# EAGLE design source_eagle (EAGLE 9.6.2)
COMPANY: ADAFRUIT INDUSTRIES; DRAWN: KTOWN; REV: A; YEAR: 2017
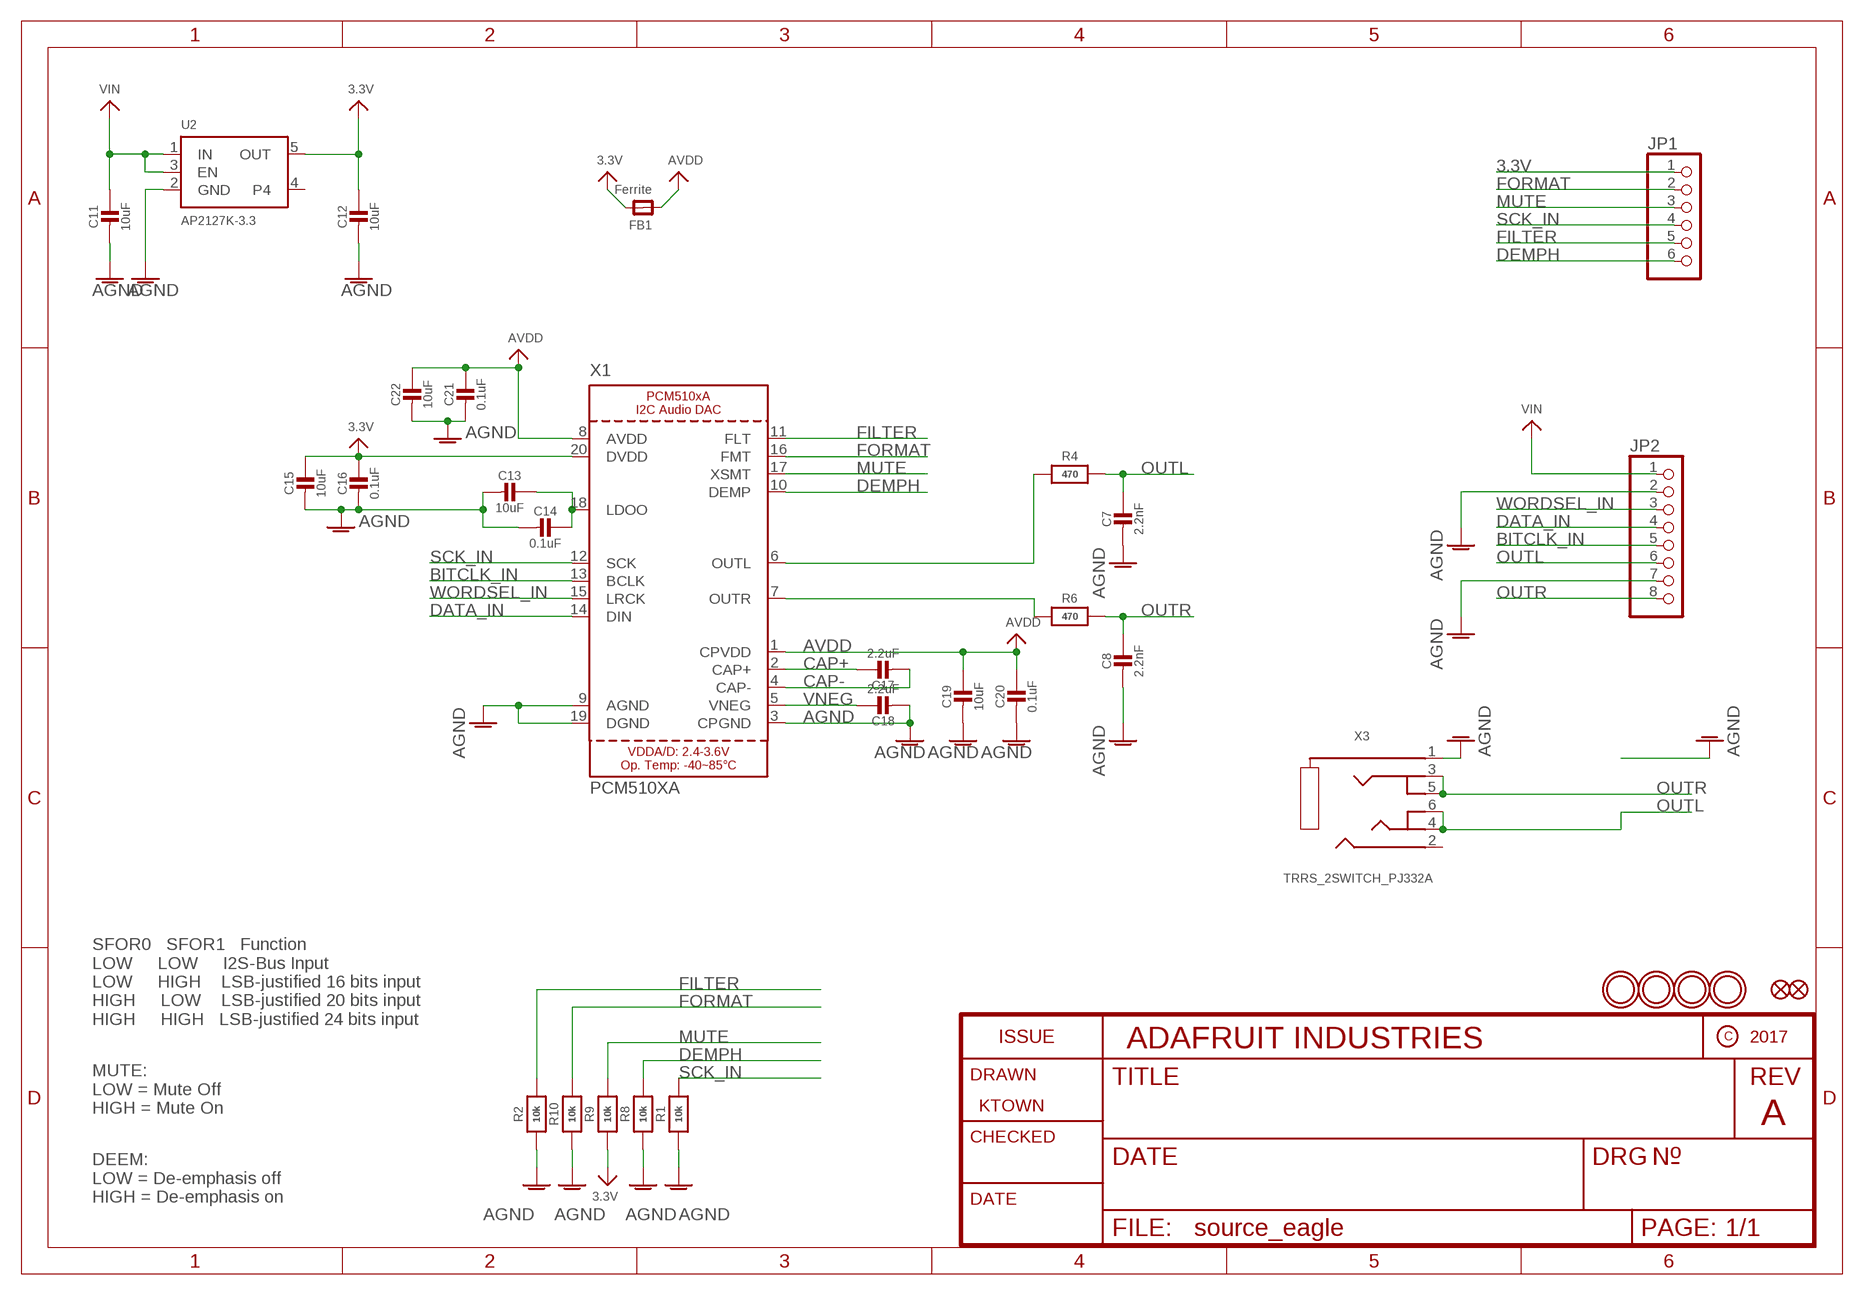
[diagram p0: schematic, sheet 1]

## Parts
C7  2.2nF  CAP_CERAMIC0603_NO  [0603-NO]
C8  2.2nF  CAP_CERAMIC0603_NO  [0603-NO]
C11  10uF  CAP_CERAMIC0805-NOOUTLINE  [0805-NO]
C12  10uF  CAP_CERAMIC0805-NOOUTLINE  [0805-NO]
C13  10uF  CAP_CERAMIC0805-NOOUTLINE  [0805-NO]
C14  0.1uF  CAP_CERAMIC0603_NO  [0603-NO]
C15  10uF  CAP_CERAMIC0805-NOOUTLINE  [0805-NO]
C16  0.1uF  CAP_CERAMIC0603_NO  [0603-NO]
C17  2.2uF  CAP_CERAMIC0603_NO  [0603-NO]
C18  2.2uF  CAP_CERAMIC0603_NO  [0603-NO]
C19  10uF  CAP_CERAMIC0805-NOOUTLINE  [0805-NO]
C20  0.1uF  CAP_CERAMIC0603_NO  [0603-NO]
C21  0.1uF  CAP_CERAMIC0603_NO  [0603-NO]
C22  10uF  CAP_CERAMIC0805-NOOUTLINE  [0805-NO]
FB1  Ferrite  FERRITE-0603NO  [0603-NO]
FID1  FIDUCIAL_0.5MM  [FIDUCIAL_0.5MM]
FID2  FIDUCIAL_0.5MM  [FIDUCIAL_0.5MM]
JP1  HEADER-1X670MIL  [1X06_ROUND_70]
JP2  HEADER-1X8ROUND  [1X08_ROUND]
R1  10k  RESISTOR_0603_NOOUT  [0603-NO]
R2  10k  RESISTOR_0603_NOOUT  [0603-NO]
R4  470  RESISTOR_0603_NOOUT  [0603-NO]
R6  470  RESISTOR_0603_NOOUT  [0603-NO]
R8  10k  RESISTOR_0603_NOOUT  [0603-NO]
R9  10k  RESISTOR_0603_NOOUT  [0603-NO]
R10  10k  RESISTOR_0603_NOOUT  [0603-NO]
U2  AP2127K-3.3  VREG_SOT23-5  [SOT23-5]
U$11  MOUNTINGHOLE2.5  [MOUNTINGHOLE_2.5_PLATED]
U$12  MOUNTINGHOLE2.5  [MOUNTINGHOLE_2.5_PLATED]
U$13  MOUNTINGHOLE2.5  [MOUNTINGHOLE_2.5_PLATED]
U$14  MOUNTINGHOLE2.5  [MOUNTINGHOLE_2.5_PLATED]
X1  PCM510XA  [TSSOP20]
X3  TRRS_2SWITCH_PJ332A  [PJ-332A]

## Nets
3.3V: C12.1 C15.1 C16.1 FB1.2 JP1.1 R9.1 U2.5(OUT) X1.20(DVDD)
AGND: C7.2 C8.2 C11.2 C12.2 C13.2 C14.2 C15.2 C16.2 C18.2 C19.2 C20.2 C21.2 C22.2 JP2.2 JP2.7 R1.1 R2.1 R8.1 R10.1 U2.2(GND) X1.3(CPGND) X1.9(AGND) X1.19(DGND) X3.1(RING)
AVDD: C19.1 C20.1 C21.1 C22.1 FB1.1 X1.1(CPVDD) X1.8(AVDD)
BITCLK_IN: JP2.5 X1.13(BCLK)
CAP+: C17.1 X1.2(CAP+)
CAP-: C17.2 X1.4(CAP-)
DATA_IN: JP2.4 X1.14(DIN)
DEMPH: JP1.6 R8.2 X1.10(DEMP)
FILTER: JP1.5 R2.2 X1.11(FLT)
FORMAT: JP1.2 R10.2 X1.16(FMT)
MUTE: JP1.3 R9.2 X1.17(XSMT)
N$1: R6.1 X1.7(OUTR)
N$2: R4.1 X1.6(OUTL)
N$5: C13.1 C14.1 X1.18(LDOO)
OUTL: C7.1 JP2.6 R4.2 X3.4(TIP) X3.6(TIP_SW)
OUTR: C8.1 JP2.8 R6.2 X3.3(RING2) X3.5(R2_SW)
SCK_IN: JP1.4 R1.2 X1.12(SCK)
VIN: C11.1 JP2.1 U2.1(IN) U2.3(EN)
VNEG: C18.1 X1.5(VNEG)
WORDSEL_IN: JP2.3 X1.15(LRCK)
Unconnected: U2.4 X3.2(RING1)

## Notes on the sheet
- SFOR0   SFOR1   Function
  LOW     LOW     I2S-Bus Input
  LOW     HIGH    LSB-justified 16 bits input 
  HIGH     LOW    LSB-justified 20 bits input 
  HIGH     HIGH   LSB-justified 24 bits input
- MUTE:
  LOW = Mute Off
  HIGH = Mute On
- DEEM:
  LOW = De-emphasis off
  HIGH = De-emphasis on

## Library data of the parts
C7 C8 C11-C22 = microbuilder:CAP_CERAMIC: Ceramic Capacitors For new designs, use the packages preceded by an '_' character since they are more reliable: The following footprints should be used on most boards: _0402 - Standard footprint for regular board layouts _0603 - Standard footprint for regular board layouts _0805 - Standard footprint for regular board layouts _1206 - Standard footprint for regular board layouts For extremely tight-pitch boards where space is at a premium, the following 'micro-pitch' footprints can be used (smaller pads, no silkscreen outline, etc.): _0402MP - Micro-pitch footprint for very dense/compact boards _0603MP - Micro-pitch footprint for very dense/compact boards _0805MP - Micro-pitch footprint for very dense/compact boards _1206MP - Micro-pitch footprint for very dense/compact boards
FB1 = microbuilder:FERRITE: Ferrite Bead 0603 MMZ1608B121C - 120 Ohm @ 100MHz, 600mA, 0.15 Ohm DC Resistance - Digikey: 445-2164-1-ND BK1608HW121-T - 120 Ohm, 600mA Ferrite Chip - Digikey: 587-1876-2-ND 0805 HZ0805B272R-10 - 2.7K Ohm @ 100MHz, 200mA, 0.8 Ohm DC Resistance - Digikey: 240-2504-1-ND (see also Murata BLM21BD272SN1L) MMZ2012Y152B - 1.5K Ohm @ 100MHz, 500mA, 0.4 Ohm DC Resistance - Digikey: 445-1560-1-ND - Mainly for high frequency (80-400MHz) MMZ2012R102A - 1K Ohm @ 100MHz, 500mA, 0.3 Ohm DC Resistance - Digikey: 445-1555-2-ND - More general purpose (10-200MHz)
FID1 FID2 = microbuilder:FIDUCIAL: Fiducial Alignment Points Various fiducial points for machine vision alignment.
JP1 = microbuilder:HEADER-1X6: PIN HEADER
JP2 = microbuilder:HEADER-1X8: PIN HEADER
R1 R2 R4 R6 R8-R10 = microbuilder:RESISTOR: Resistors For new designs, use the packages preceded by an '_' character since they are more reliable: The following footprints should be used on most boards: _0402 - Standard footprint for regular board layouts _0603 - Standard footprint for regular board layouts _0805 - Standard footprint for regular board layouts _1206 - Standard footprint for regular board layouts For extremely tight-pitch boards where space is at a premium, the following 'micro-pitch' footprints can be used (smaller pads, no silkscreen outline, etc.): _0402MP - Micro-pitch footprint for very dense/compact boards _0603MP - Micro-pitch footprint for very dense/compact boards _0805MP - Micro-pitch footprint for very dense/compact boards _1206MP - Micro-pitch footprint for very dense/compact boards
U2 = adafruit_power:VREG_SOT23-5: SOT23-5 Fixed Voltage Regulators Part Current Out V Out V In V Dropout θJA (°C/W) TJ (°C) Digikey Part No. ADP121 150mA 3.3V 3.4-5.5V 0.09V @ 150mA -- -- ADP121-AUJZ33R7CT-ND ADP121 150mA 3.0V 3.1-5.5V 0.09V @ 150mA -- -- ADP121-AUJZ30R7CT-ND ADP122 300mA 3.3V 3.4-5.5V 0.085V @ 300mA -- -- ADP122AUJZ-3.3-R7CT-ND ADP1712 300mA 3.3V 3.5-5.5V 0.17V @ 300mA -- -- ADP1712AUJZ-3.3-R7TR-ND AP7311 (Low Cost) 150mA 3.3V 3.5-6V 0.15V @ 150mA -- -- AP7311-33WG-7DICT-ND LD39015M18R 150mA 1.8V 1.9V-5.5V 0.08V @ 100mA -- -- 497-6977-1-ND LP2985A-33DBVR 150mA 3.3V 3.3-16V 0.28V @ 150mA 206 150 296-18479-1-ND MCP1824T-3302E/OT 300mA 3.3V 3.5V-6V 0.2V @ 300mA -- -- MCP1824T-3302E/OTCT-ND MIC5205-2.5YM5 TR 150mA 2.5V 2.7-16V 0.165V @ 150mA -- -- 576-1257-2-ND MIC5205-3.0YM5 TR 150mA 3.0V 3.2V-16V 0.165V @ 150mA -- -- 576-1258-2-ND MIC5205-3.3YM5 TR 150mA 3.3V 3.5V-16V 0.165V @ 150mA -- -- 576-1259-2-ND TPS780330220 150mA 3.3V+2.2V 3.6-5.5V 250mV Max -- -- 296-23332-1-ND TDA3663/N1,135 100mA 3.3V 3.5-45V 0.18V @ 50mA -- -- 568-5343-1-ND Max operating temp can be calculated using θJA, TJ (max junction temperature), and power in watts. Set the "Maximum Ambient Temperature" until it reaches TJ ("Max Junction Temperature"), which is the absolute limit for safe use of the regulator: Heat Sink Temperature Calculator <http://www.daycounter.com/Calculators/Heat-Sink-Temperature-Calculator.phtml> For example, With 12V source into a 3.3V LP2985 and a 30mA load, we are dissipating (12V-3.3V) * 0.03A = 0.261W. With a θJA of 206 °C/W, a TJ of 150°C, and 261mW we can safely use the chip without a heat sink up to 75°C (=147.1°C Junction Temperature).; JLC_ROTATION: 270
U$11-U$14 = adafruit_electromech:MOUNTINGHOLE: Mounting Hole For #2 screws (0.086"/2.18mm width, 0.094"/2.4mm hole) use 2.5mm; BOM: EXCLUDE
X1 = microbuilder:PCM510XA
X3 = adafruit_electromech:TRRS_2SWITCH

## Board
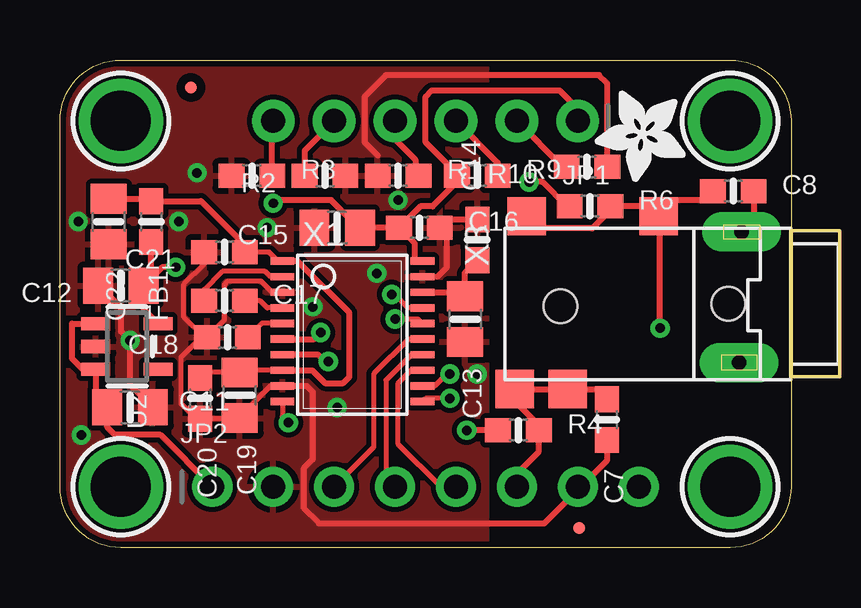
[diagram p1: board, top side]
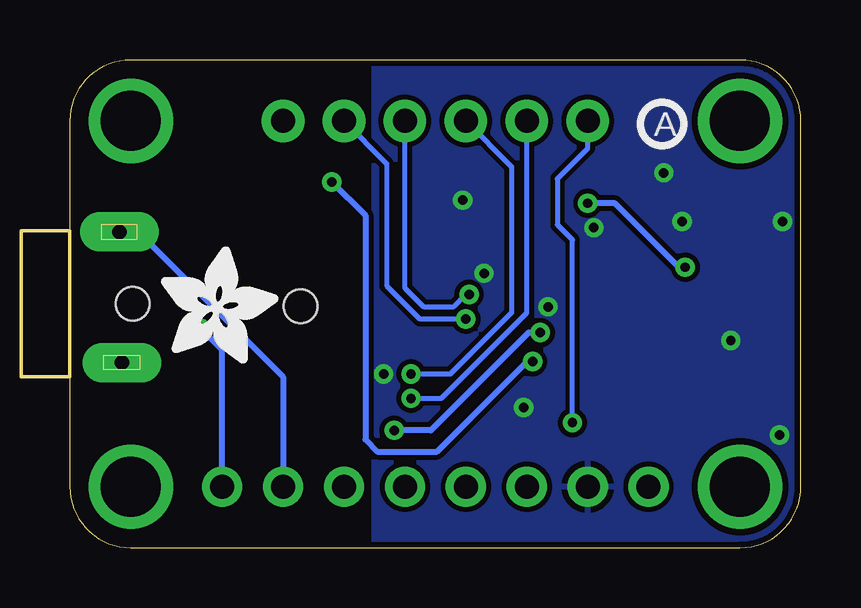
[diagram p2: board, bottom side, seen from below]

Size 30.48 x 20.32 mm. Coordinates in mm from the lower left corner, seen from the top.
Outline: 2.54,20.32 27.94,20.32 arc-90 30.48,17.78 30.48,2.54 arc-90 27.94,0 2.54,0 arc-90 0,2.54 0,17.78 arc-90 2.54,20.32
Copper layers (1*16): Top 0.035mm / dielectric 1.5mm / Bottom 0.035mm
Design rules "adafruit *": minimum track width 8mil, minimum drill 15.5mil, track to track 8mil, track to pad 8mil, pad to pad 8mil, via to via 8mil, smd to smd 8mil, copper to edge 10mil, drill to drill 8mil, minimum pad ring 10mil, minimum via ring 8mil, stop-mask expansion 2mil, vias tented up to drill 20mil, thermal gap 10mil

### Footprints (pad centres in the part's own frame; a part is rotated, then mirrored left to right if it is on the bottom)
0603-NO = smd 1.075 x 1: 1 -0.85,0; 2 0.85,0
0805-NO = smd 1.24 x 1.5: 1 -0.95,0; 2 0.95,0
FIDUCIAL_0.5MM = smd 0.5 x 0.5: 1 0,0
1X06_ROUND_70 = drill 1 pad 1.778: 1 -6.35,0; 2 -3.81,0; 3 -1.27,0; 4 1.27,0; 5 3.81,0; 6 6.35,0
1X08_ROUND = drill 1 pad 1.676: 1 -8.89,0; 2 -6.35,0; 3 -3.81,0; 4 -1.27,0; 5 1.27,0; 6 3.81,0; 7 6.35,0; 8 8.89,0
SOT23-5 = smd 0.55 x 1.2: 1 -0.95,-1.3; 2 0,-1.3; 3 0.95,-1.3; 4 0.95,1.3; 5 -0.95,1.3
MOUNTINGHOLE_2.5_PLATED = drill 2.5 pad 3.2: P$1 0,0
TSSOP20 = smd 0.305 x 0.991: 1 -2.925,-2.918; 2 -2.275,-2.918; 3 -1.625,-2.918; 4 -0.975,-2.918; 5 -0.325,-2.918; 6 0.325,-2.918; 7 0.975,-2.918; 8 1.625,-2.918; 9 2.275,-2.918; 10 2.925,-2.918; 11 2.925,2.918; 12 2.275,2.918; 13 1.625,2.918; 14 0.975,2.918; 15 0.325,2.918; 16 -0.325,2.918; 17 -0.975,2.918; 18 -1.625,2.918; 19 -2.275,2.918; 20 -2.925,2.918
PJ-332A = drill 0.6 pad 1.651 long: 1 -4.792,-3; 2 -4.692,2.45 | smd 1.6 x 1.6: 3 -1.342,-3.65; 4 2.458,3.55; 5 4.158,-3.65; 6 4.658,3.55 | hole 1.4: -4.242,0; 2.758,0.1

### Placement (x,y rotation side)
C7  22.8,5.33 270 top
C8  28.07,14.86 0 top
C11  2.92,5.84 0 top
C12  2.54,10.92 180 top
C13  16.89,9.53 270 top
C14  17.4,12.83 90 top
C15  11.56,13.34 180 top
C16  14.99,13.34 0 top
C17  6.86,10.29 0 top
C18  6.99,8.76 180 top
C19  7.49,6.35 270 top
C20  5.84,6.22 270 top
C21  6.86,12.32 180 top
C22  2.03,13.59 270 top
FB1  3.81,13.59 270 top
FID1  21.65,0.83 0 top
FID2  5.46,19.18 0 top
JP1  15.24,17.78 180 top
JP2  15.24,2.54 0 top
PLABEL0  [PLABEL0]  24.26,1.14 0 top
PLABEL1  [PLABEL1]  19.05,1.14 0 top
PLABEL2  [PLABEL2]  6.35,4.06 0 top
PLABEL3  [PLABEL3]  21.59,19.43 0 top
PLABEL4  [PLABEL4]  9.02,1.02 0 top
PLABEL5  [PLABEL5]  16.38,4.06 0 top
PLABEL6  [PLABEL6]  11.43,4.19 0 top
PLABEL7  [PLABEL7]  14.1,0.89 0 top
PLABEL8  [PLABEL8]  13.78,19.43 0 top
PLABEL9  [PLABEL9]  8.38,19.43 0 top
PLABEL10  [PLABEL10]  19.37,19.43 0 top
PLABEL11  [PLABEL11]  10.99,19.43 0 top
PLABEL12  [PLABEL12]  21.53,4.13 0 top
PLABEL13  [PLABEL13]  16.83,19.43 0 top
PLABEL16  [PLABEL16]  26.16,5.33 0 bottom
PLABEL17  [PLABEL17]  23.43,5.84 0 top
PLABEL18  [PLABEL18]  14.61,14.8 0 bottom
PLABEL19  [PLABEL19]  19.62,10.16 0 bottom
R1  14.1,15.49 0 top
R2  11.05,15.49 180 top
R4  19.11,4.89 0 top
R6  22.1,14.22 0 top
R8  8,15.49 0 top
R9  17.4,15.49 0 top
R10  21.97,15.88 180 top
U2  2.79,8.38 270 top
U$5  [PCBFEAT-REV-040]  5.78,17.65 0 bottom
U$6  [ADAFRUIT_5MM]  26.67,7.68 0 bottom
U$11  2.54,2.54 0 top
U$12  27.94,2.54 0 top
U$13  2.54,17.78 0 top
U$14  27.94,17.78 0 top
U$29  [ADAFRUIT_3.5MM]  26.1,19.05 180 top
X1  12.19,9.02 270 top
X3  23.62,10.16 180 top

### Tracks (layer width: path | path; a pad name or v marks a point on that pad's centre or on a via)
3.3V  (via drill 0.39)
  Top 0.254: U2.5 3.49,9.94 C12.1 4.12,11.56 | FB1.2 3.81,11.56 4.12,11.56 | X1.20 14.77,11.94 14.77,12.7 C16.1 | C16.1 C15.1 12.45,13.34 11.3,14.48 9.02,14.48 v8.89,14.35 | 4.12,11.56 4.25,11.68 v4.83,11.68 | C16.1 15.03,14.22 15.53,14.22 16.55,15.24 R9.1 16.55,15.58 15.24,16.89 15.24,18.8 15.49,19.05 20.83,19.05 21.59,18.29 JP1.1
  Bottom 0.254: v4.83,11.68 5.08,11.68 7.75,14.35 v8.89,14.35
AGND  (via drill 0.39)
  Top 0.203: C18.2 6.01,8.76 5.17,9.61 5.17,10.97 6.01,11.81 C21.2 | C18.2 5.88,8.76 5.04,7.92 5.04,6.01 5.68,5.37 C20.2 7.47,5.37 C19.2 7.27,5.63 7.66,5.63 8.77,6.74 X1.9 | X1.3 8.85,10.64 8.4,11.09 6.98,11.09 6.85,10.96 6.85,9.48 C18.2
  Top 0.254: C7.2 22.8,3.62 21.72,2.54 | 21.72,2.54 JP2.7 | X3.1 28.92,13.66 C8.2 | X1.9 10.29,6.74 10.54,6.49 10.54,3.68 10.16,3.3 10.16,1.65 10.79,1.02 20.19,1.02 21.72,2.54 | C12.2 1.63,10.92 2.54,10.01 2.54,9.02 v2.92,8.64 2.92,6.79 C11.2 | R10.1 22.82,19.34 22.48,19.68 13.59,19.68 12.7,18.8 12.7,16.89 13.25,16.34 | 15.74,11.29 16.13,11.68 16.13,13.17 15.98,13.32 | C16.2 15.98,13.19 15.98,13.32 | C14.2 16.3,13.68 15.98,13.35 15.98,13.32
  Bottom 0.254: X3.1 27.64,13.16 21.59,7.11 JP2.7
  other vias: 13.21,11.43 11.56,5.84 0.76,13.59 8.64,13.34 14.1,14.48 17.4,7.24 0.89,4.7 4.95,13.59 5.71,15.62 10.54,10.03
  pour Bottom: 0,20.32 0,0 17.78,0 17.78,20.32
  pour Top: 0,20.32 0,0 17.78,0 17.78,20.32
AVDD
  Top 0.203: X1.1 9.1,11.94 8.72,12.32 C21.1 | X1.8 7.58,7.39 C19.1 6.07,7.3 C20.1
  Top 0.254: X1.8 10.52,7.39 11.05,6.86 11.81,6.86 12.06,7.11 12.06,9.78 9.9,11.94 X1.1 | C22.1 3.71,14.54 FB1.1 5.88,14.44 7.71,12.61 C21.1
BITCLK_IN
  Top 0.203: X1.13 14.63,7.39 14.1,6.86 14.1,4.32 15.88,2.54 JP2.5
CAP+
  Top 0.203: X1.2 8.77,11.29 8.55,11.51 6.77,11.51 6.01,10.75 C17.1
CAP-
  Top 0.203: X1.4 8.64,9.99 8.34,10.29 C17.2
DATA_IN
  Top 0.203: JP2.4 13.59,2.92 13.59,6.99 14.65,8.04 X1.14
DEMPH  (via drill 0.39)
  Top 0.203: X1.10 9.27,5.46 v9.53,5.21
  Top 0.254: R8.2 8.85,17.74 JP1.6
  Bottom 0.203: v9.53,5.21 9.53,12.83 10.16,13.46 10.16,15.37 8.89,16.64 JP1.6
FILTER  (via drill 0.39)
  Top 0.203: X1.11 15.24,6.22 v16.26,6.22
  Top 0.254: JP1.5 10.2,16.55 R2.2
  Bottom 0.203: v16.26,6.22 14.99,6.22 11.43,9.78 JP1.5
FORMAT  (via drill 0.39)
  Top 0.203: X1.16 14.93,9.53 v13.97,9.53
  Top 0.254: R10.2 20.95,15.88 JP1.2
  Bottom 0.203: v13.97,9.53 15.88,9.53 17.27,10.92 17.27,16 JP1.2
MUTE  (via drill 0.39)
  Top 0.203: X1.17 14.52,9.99 13.96,10.55 v13.83,10.55
  Top 0.254: JP1.3 18.25,16.04 R9.2
  Bottom 0.203: v13.83,10.55 13.96,10.55 14.47,10.04 15.74,10.04 16.51,10.82 JP1.3
N$1  (via drill 0.39)
  Top 0.254: R6.1 21.12,14.22 20.11,15.24 v19.56,15.24 | v11.18,7.75 11.04,7.75 10.75,8.04 X1.7
  Bottom 0.254: v19.56,15.24 18.16,13.84 18.16,4.51 17.65,4 15.18,4 11.3,7.87 v11.18,7.75
N$2  (via drill 0.39)
  Top 0.254: X1.6 10.6,8.69 v10.87,8.96 | R4.1 v16.95,4.89
  Bottom 0.254: v10.87,8.96 11.36,8.96 15.43,4.89 16.62,4.89 16.79,5.05 v16.95,4.89
N$5
  Top 0.254: X1.18 16.89,10.64 C13.1 16.89,11.47 C14.1
OUTL
  Top 0.254: C7.1 22.37,6.61 X3.4 X3.6 18.96,6.1 19.77,5.29 19.77,5.08 R4.2 19.96,4 19.05,3.09 JP2.6
OUTR  (via drill 0.39)
  Top 0.254: 24.55,14.22 X3.3 25.02,13.76 v25.02,9.14 | 24.55,14.22 24.3,14.48 27.22,14.48 C8.1 | 24.55,14.22 R6.2 22.95,14.06 22.19,13.3 19.97,13.3 X3.5
  Bottom 0.254: JP2.8 24.13,8.26 v25.02,9.14
SCK_IN  (via drill 0.39)
  Top 0.203: v16.26,7.24 16.13,7.24 15.63,6.74 X1.12
  Top 0.254: R1.2 14.82,15.62 14.82,16.17 13.97,17.02 JP1.4
  Bottom 0.203: v16.26,7.24 14.61,7.24 12.06,9.78 12.06,15.88 JP1.4
VIN
  Top 0.254: JP2.1 4.19,4.7 2.29,4.7 1.97,5.01 C11.1 1.49,6.32 U2.3 0.95,7.43 0.51,7.87 0.51,9.33 U2.1
VNEG
  Top 0.203: X1.5 8.41,9.34 C18.1
WORDSEL_IN
  Top 0.203: X1.15 14.53,8.69 13.08,7.24 13.08,4.19 JP2.3

### Text on the board
Pinguin_tBackup: DE | FIL | MCK | MU | FM | 3V | PCM5100 | VIN | WSEL | BCK | G | GND | DIN | Lout | Rout
Pinguin_bBackup: PCM5100 I2S DAC | 100 dB 16/24/32-bit / Samprate: 8k-384kHz / I2S or LJ, MCLK-opt. | Line Out 1KΩ Load Min / Not AC-decoupled